# Altium schematic sheet adcamp.SchDoc: ADC Amp
size Letter; CheckedBy: J. Brinton; CompanyName: Signal Laboratories, Inc.; DrawnBy: J. Brinton; Engineer: J. Brinton; Address1: 3479 Edison Way; Address2: Menlo Park CA 94025; Address3: +1 (877) 778-8435; Address4: siglabs.com; Revision: 3; SheetNumber: 15; SheetTotal: 45
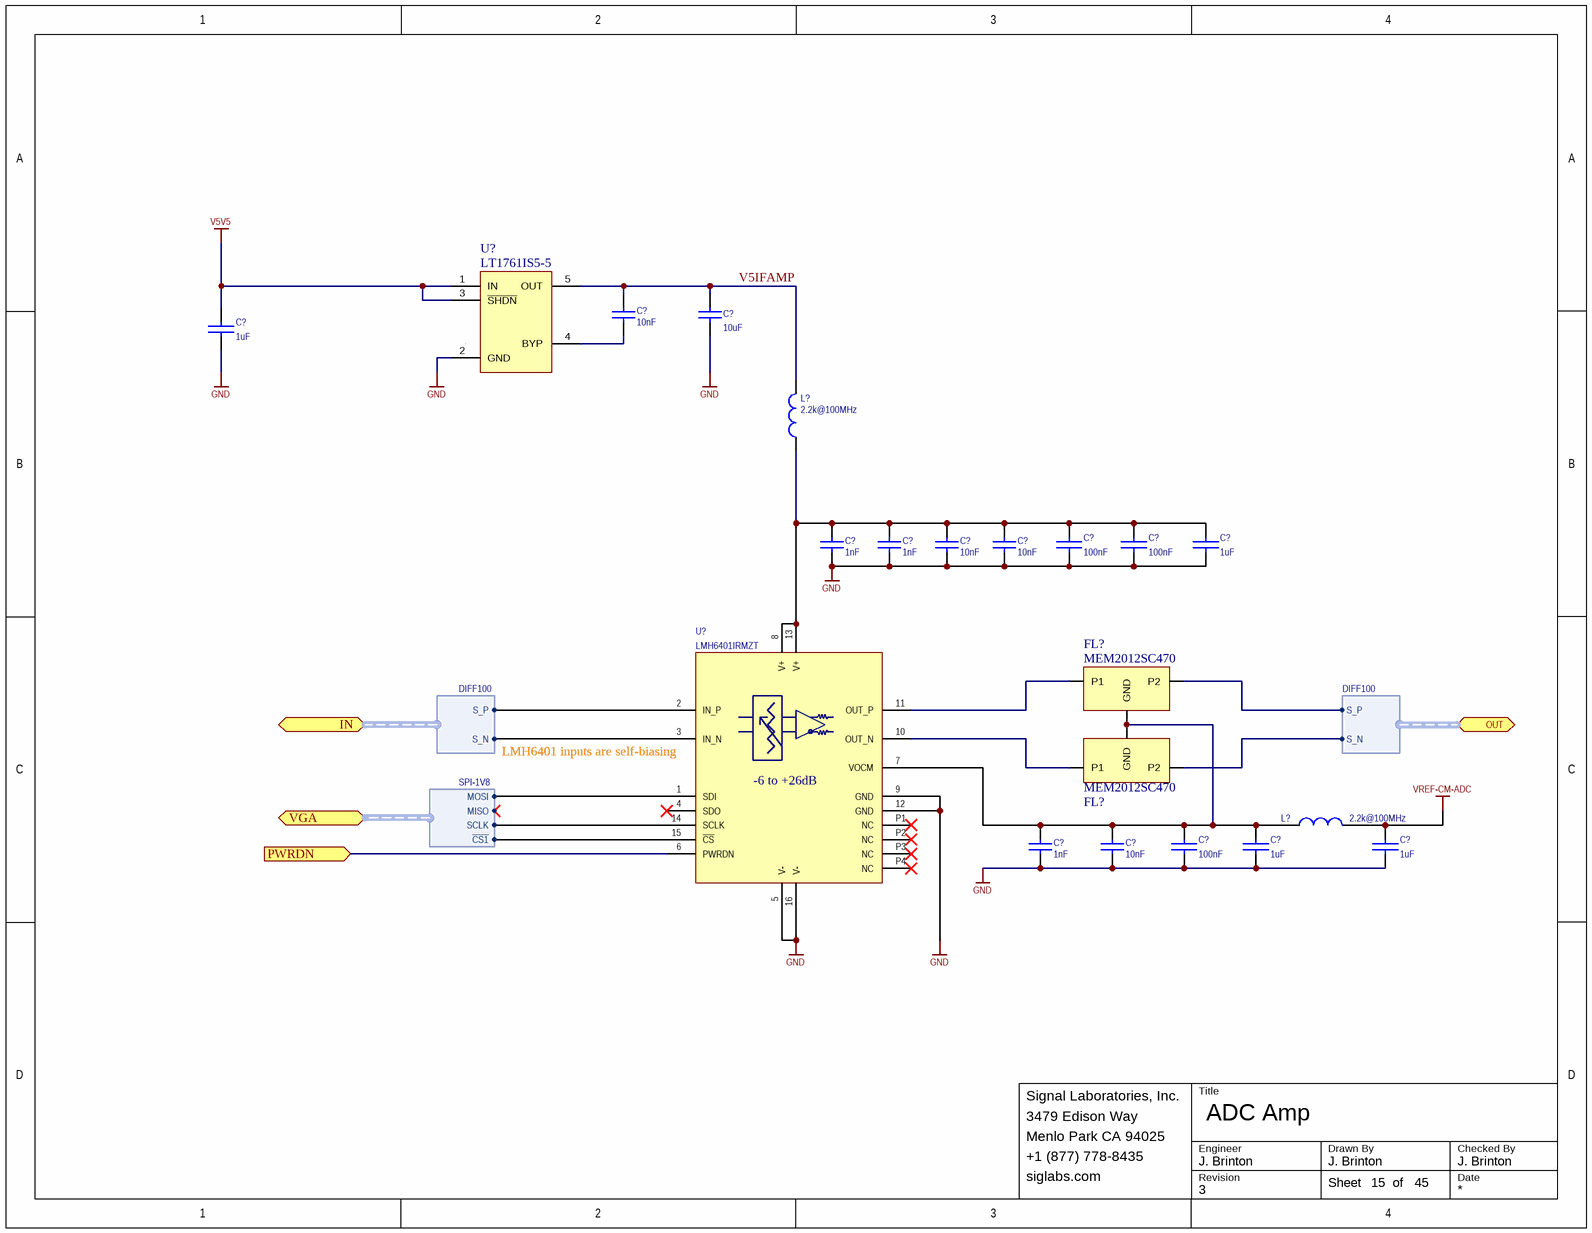
[diagram p0: adcamp.SchDoc]

## Parts
(Parts that share a designator on the sheet are numbered #1, #2 ... from top to bottom, then left to right.)
C?#1  value 10nF  [CAPC100X50X55L25N]  (hidden comment: GRM155R71H103KA88)
C?#2  value 10uF  [0603]  (hidden comment: CL10A106MA8NRNC)
C?#3  value 1uF  [CAPC100X50X55L25N]  (hidden comment: GRM155R61A105KE15D)
C?#4  value 1nF  [CAPC100X50X55L25N]  (hidden comment: GRM155R71H102KA01)
C?#5  value 1nF  [CAPC100X50X55L25N]  (hidden comment: GRM155R71H102KA01)
C?#6  value 10nF  [CAPC100X50X55L25N]  (hidden comment: GRM155R71H103KA88)
C?#7  value 10nF  [CAPC100X50X55L25N]  (hidden comment: GRM155R71H103KA88)
C?#8  value 100nF  [CAPC100X50X55L25N]  (hidden comment: GRM155R71C104KA88J)
C?#9  value 100nF  [CAPC100X50X55L25N]  (hidden comment: GRM155R71C104KA88J)
C?#10  value 1uF  [CAPC100X50X55L25N]  (hidden comment: GRM155R61A105KE15D)
C?#11  value 1nF  [CAPC100X50X55L25N]  (hidden comment: GRM155R71H102KA01)
C?#12  value 10nF  [CAPC100X50X55L25N]  (hidden comment: GRM155R71H103KA88)
C?#13  value 100nF  [CAPC100X50X55L25N]  (hidden comment: GRM155R71C104KA88J)
C?#14  value 1uF  [CAPC100X50X55L25N]  (hidden comment: GRM155R61A105KE15D)
C?#15  value 1uF  [CAPC100X50X55L25N]  (hidden comment: GRM155R61A105KE15D)
FL?#1  MEM2012SC470  [FIL_MEM2012SC470_MEM2012SC470(Primary)]
FL?#2  MEM2012SC470  [FIL_MEM2012SC470_MEM2012SC470(Primary)]
L?#1  value 2.2k@100MHz  [INDC1005X55N]  (hidden comment: MMZ1005A222ET000)
L?#2  value 2.2k@100MHz  [INDC1005X55N]  (hidden comment: MMZ1005A222ET000)
U?#1  LT1761IS5-5  [TSOT-5]
U?#2  LMH6401IRMZT  [RMZ-UQFN-16]

## Ports
IN (harness DIFF100), OUT (harness DIFF100), PWRDN (in), VGA (harness SPI-1V8)

## Harnesses
DIFF100: S_P, S_N
SPI-1V8: MOSI, MISO, SCLK, ~{CS1}

## Nets
GND: C?#2.1 C?#3.1 C?#4.1 C?#5.1 C?#6.1 C?#7.1 C?#8.1 C?#9.1 C?#10.1 C?#11.2 C?#12.2 C?#13.1 C?#14.1 C?#15.1 U?#1.2(GND) U?#2.5(V-) U?#2.9(GND) U?#2.12(GND) U?#2.16(V-)
V5V5: C?#3.2 U?#1.1(IN) U?#1.3(~{SHDN})
VREF-CM-ADC: C?#15.2 L?#2.2
PWRDN: U?#2.6(PWRDN) ; port PWRDN
V5IFAMP: C?#1.2 C?#2.2 L?#1.2 U?#1.5(OUT)
NetC?#1_1: C?#1.1 U?#1.4(BYP)
NetC?#4_2: C?#4.2 C?#5.2 C?#6.2 C?#7.2 C?#8.2 C?#9.2 C?#10.2 L?#1.1 U?#2.8(V+) U?#2.13(V+)
NetC?#11_1: C?#11.1 C?#12.1 C?#13.2 C?#14.2 FL?#1.2_5(GND) FL?#2.2_5(GND) L?#2.1 U?#2.7(VOCM)
NetFL?#1_1: FL?#1.1(P1) U?#2.11(OUT_P)
NetFL?#1_3: FL?#1.3(P2) ; port OUT.S_P
NetFL?#2_1: FL?#2.1(P1) U?#2.10(OUT_N)
NetFL?#2_3: FL?#2.3(P2) ; port OUT.S_N
NetU?#2_1: U?#2.1(SDI) ; port VGA.MOSI
NetU?#2_2: U?#2.2(IN_P) ; port IN.S_P
NetU?#2_3: U?#2.3(IN_N) ; port IN.S_N
NetU?#2_14: U?#2.14(SCLK) ; port VGA.SCLK
NetU?#2_15: U?#2.15(~{CS}) ; port VGA.~{CS1}

Not connected (* = marked no-connect by the designer): U?#2 4(SDO)* P1(NC)* P2(NC)* P3(NC)* P4(NC)*

## Notes on the sheet
- (near U?#2) LMH6401 inputs are self-biasing
- Title
- Engineer
- Revision
- Drawn By
- Checked By
- Date
- Sheet
- of
- (in symbol LMH6401) -6 to +26dB

## Library data of the parts
C?#1 C?#6 C?#7 C?#12 = CAP 0402: Ceramic Capacitor 10nF ±10% 50V X7R 0402; Manufacturer: Murata; Tr: -55:125; Voltage: 50V; Manufacturer P/N: GRM155R71H103KA88; Package: 0402; Tolerance: ±10%
C?#2 = CAP 0603: Ceramic Capacitor 10uF ±20% 25V X5R 0603; Manufacturer: Samsung; Tr: -55:85; Manufacturer P/N: CL10A106MA8NRNC; Voltage: 25V; Package: 0603; Tolerance: ±20%
C?#3 C?#10 C?#14 C?#15 = CAP: Ceramic Capacitor 1uF ±10% 10V X5R 0402; Manufacturer: Murata; Tr: -55:125; Manufacturer P/N: GRM155R61A105KE15D; Package: 0402; Tolerance: ±10%; Voltage: 10V
C?#4 C?#5 C?#11 = CAP 0402: Ceramic Capacitor 1nF ±10% 50V X7R 0402; Manufacturer: Murata; Tolerance: ±5%; Tr: -55:125; Voltage: 50V; Manufacturer P/N: GRM155R71H102KA01; Package: CAPC100X50X55L25N
C?#8 C?#9 C?#13 = CAP: Ceramic Capacitor 100nF ±10% 16V X7R 0402; Manufacturer: Murata; Tr: -55:125; Manufacturer P/N: GRM155R71C104KA88J; Voltage: 16V; Package: 0402; Tolerance: ±10%
FL?#1 FL?#2 = MEM2012SC470: EMI Filter 1A 12V Flat Style SMD Punched Paper T/R; MF: TDK; Package: 0805 TDK; MP: MEM2012SC470; Availability: Good; Price: 0.30 USD; SnapEDA_Link: https://www.snapeda.com/symbols-footprints/MEM2012SC470/TDK/view-part/?ref=snap; Value: *
L?#1 L?#2 = INDUCTANCE1: Ferrite Bead 2.2k@100MHz 150mA 0402; Manufacturer: TDK; Tr: -55:125; Manufacturer P/N: MMZ1005A222ET000; Package: 0402
U?#1 = LT1761IS5-5: 100mA Low Noise LDO 5V; Manufacturer: Linear Technologies; Manufacturer P/N: LT1761IS5-5
U?#2 = LMH6401: Fully Differential Variable Gain Amplifier, DC to 4.5GHz; Manufacturer: Texas Instruments; Manufacturer P/N: LMH6401IRMZT